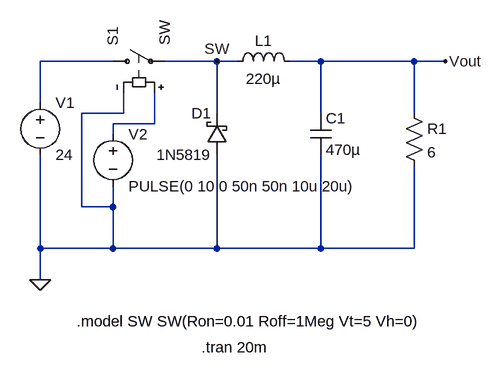
[diagram p0: schematic buck_converter.asc.asc]
buck_converter.asc.asc, the LTspice schematic file:
Version 4.1
SHEET 1 880 680
WIRE 128 -32 16 -32
WIRE 288 -32 208 -32
WIRE 320 -32 288 -32
WIRE 448 -32 400 -32
WIRE 592 -32 448 -32
WIRE 640 -32 592 -32
WIRE 16 32 16 -32
WIRE 144 48 144 16
WIRE 144 48 80 48
WIRE 288 48 288 -32
WIRE 448 48 448 -32
WIRE 592 48 592 -32
WIRE 192 64 192 16
WIRE 192 64 128 64
WIRE 128 80 128 64
WIRE 80 192 80 48
WIRE 128 192 128 160
WIRE 128 192 80 192
WIRE 16 256 16 112
WIRE 128 256 128 192
WIRE 128 256 16 256
WIRE 288 256 288 112
WIRE 288 256 128 256
WIRE 448 256 448 112
WIRE 448 256 288 256
WIRE 592 256 592 128
WIRE 592 256 448 256
WIRE 16 304 16 256
FLAG 16 304 0
FLAG 640 -32 Vout
FLAG 288 -32 SW
SYMBOL voltage 16 16 R0
WINDOW 123 0 0 Left 0
WINDOW 39 0 0 Left 0
SYMATTR InstName V1
SYMATTR Value 24
SYMBOL ind 304 -16 R270
WINDOW 0 32 56 VTop 2
WINDOW 3 5 56 VBottom 2
SYMATTR InstName L1
SYMATTR Value 220µ
SYMATTR SpiceLine Rser=1m
SYMBOL cap 432 48 R0
SYMATTR InstName C1
SYMATTR Value 470µ
SYMBOL res 576 32 R0
SYMATTR InstName R1
SYMATTR Value 6
SYMBOL voltage 128 64 R0
WINDOW 123 0 0 Left 0
WINDOW 39 0 0 Left 0
SYMATTR InstName V2
SYMATTR Value PULSE(0 10 0 50n 50n 10u 20u)
SYMBOL schottky 304 112 R180
WINDOW 0 24 64 Left 2
WINDOW 3 24 0 Left 2
SYMATTR InstName D1
SYMATTR Value 1N5819
SYMATTR Description Diode
SYMATTR Type diode
SYMBOL sw 112 -32 R270
SYMATTR InstName S1
TEXT 72 368 Left 2 !.model SW SW(Ron=0.01 Roff=1Meg Vt=5 Vh=0)
TEXT 264 408 Left 2 !.tran 20m

The netlist it stands for:
* buck_converter.asc.asc
V1 N001 0 24
L1 SW Vout 220µ Rser=1m
C1 Vout 0 470µ
R1 Vout 0 6
V2 N002 0 PULSE(0 10 0 50n 50n 10u 20u)
D1 0 SW 1N5819
S1 N001 SW N002 0 SW
.model D D
.lib standard.dio
.model SW SW(Ron=0.01 Roff=1Meg Vt=5 Vh=0)
.tran 20m
.backanno
.end